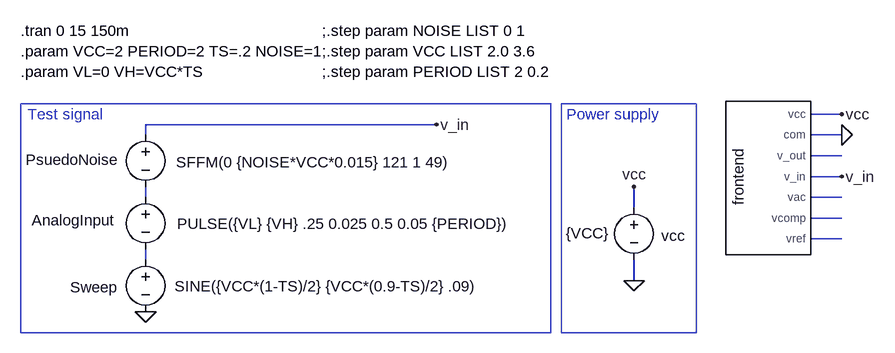
[diagram p0: schematic frontend-test.asc]
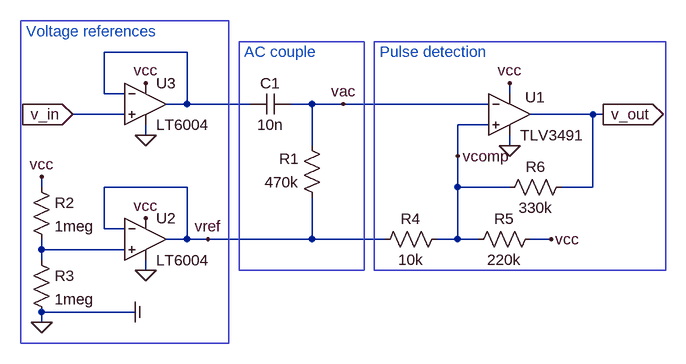
[diagram p1: sub-circuit frontend.asc]
frontend-test.asc, the LTspice schematic file:
Version 4
SHEET 1 2788 5112
WIRE -224 -112 -272 -112
WIRE -848 -96 -1296 -96
WIRE -1296 -80 -1296 -96
WIRE -224 -80 -272 -80
WIRE -224 -48 -272 -48
WIRE -224 -16 -272 -16
WIRE -1296 16 -1296 0
WIRE -224 16 -272 16
WIRE -544 32 -544 0
WIRE -224 48 -272 48
WIRE -224 80 -272 80
WIRE -1296 112 -1296 96
WIRE -544 144 -544 112
FLAG -544 144 0
FLAG -1296 192 0
FLAG -848 -96 v_in
FLAG -544 0 vcc
FLAG -224 -112 vcc
FLAG -224 -16 v_in
FLAG -224 -80 0
SYMBOL voltage -544 16 R0
WINDOW 3 -38 55 Right 2
WINDOW 123 0 0 Left 2
WINDOW 39 0 0 Left 2
WINDOW 0 78 59 Right 2
SYMATTR Value {VCC}
SYMATTR InstName vcc
SYMBOL voltage -1296 -96 R0
WINDOW 0 -113 70 Bottom 2
WINDOW 3 47 58 Left 2
WINDOW 123 0 0 Left 2
WINDOW 39 93 56 VBottom 2
SYMATTR InstName PsuedoNoise
SYMATTR Value SFFM(0 {NOISE*VCC*0.015} 121 1 49)
SYMBOL voltage -1296 0 R0
WINDOW 0 -111 67 Bottom 2
WINDOW 3 49 57 Left 2
WINDOW 123 0 0 Left 2
WINDOW 39 0 0 Left 2
SYMATTR InstName AnalogInput
SYMATTR Value PULSE({VL} {VH} .25 0.025 0.5 0.05 {PERIOD})
SYMBOL voltage -1296 96 R0
WINDOW 0 -116 58 Left 2
WINDOW 3 45 57 Left 2
WINDOW 123 0 0 Left 2
WINDOW 39 0 0 Left 2
SYMATTR InstName Sweep
SYMATTR Value SINE({VCC*(1-TS)/2} {VCC*(0.9-TS)/2} .09)
SYMBOL frontend -304 -16 R0
WINDOW 0 -79 44 VLeft 2
SYMATTR InstName frontend
TEXT -1488 -240 Left 2 !.tran 0 15 150m \n.param VCC=2 PERIOD=2 TS=.2 NOISE=1\n.param VL=0 VH=VCC*TS
TEXT -1360 -112 Right 2 ;Test signal
TEXT -648 -112 Left 2 ;Power supply
TEXT -1024 -240 Left 2 !;.step param NOISE LIST 0 1\n;.step param VCC LIST 2.0 3.6\n;.step param PERIOD LIST 2 0.2
RECTANGLE Normal -1488 -128 -672 224
RECTANGLE Normal -448 224 -656 -128

frontend.asc, the sub-circuit schematic file:
Version 4
SHEET 1 920 680
WIRE -336 -432 -464 -432
WIRE -464 -368 -464 -432
WIRE -432 -368 -464 -368
WIRE 160 -368 160 -384
WIRE -336 -352 -336 -432
WIRE -336 -352 -368 -352
WIRE -240 -352 -336 -352
WIRE -144 -352 -176 -352
WIRE -96 -352 -144 -352
WIRE 128 -352 -96 -352
WIRE -432 -336 -512 -336
WIRE 288 -336 192 -336
WIRE 304 -336 288 -336
WIRE 128 -320 80 -320
WIRE -400 -304 -400 -320
WIRE -144 -288 -144 -352
WIRE 160 -288 160 -304
WIRE 80 -272 80 -320
WIRE -560 -224 -560 -240
WIRE -336 -224 -464 -224
WIRE 80 -224 80 -272
WIRE 160 -224 80 -224
WIRE 288 -224 288 -336
WIRE 288 -224 240 -224
WIRE -464 -160 -464 -224
WIRE -432 -160 -464 -160
WIRE -336 -144 -336 -224
WIRE -336 -144 -368 -144
WIRE -304 -144 -336 -144
WIRE -144 -144 -144 -208
WIRE -144 -144 -304 -144
WIRE -32 -144 -144 -144
WIRE 80 -144 80 -224
WIRE 80 -144 48 -144
WIRE 112 -144 80 -144
WIRE 224 -144 192 -144
WIRE -560 -128 -560 -144
WIRE -432 -128 -560 -128
WIRE -560 -112 -560 -128
WIRE -400 -96 -400 -112
WIRE -416 -32 -560 -32
WIRE -560 -16 -560 -32
FLAG 160 -384 vcc
FLAG 160 -288 0
FLAG 304 -336 v_out
IOPIN 304 -336 Out
FLAG -96 -352 vac
FLAG -560 -240 vcc
FLAG -400 -176 vcc
FLAG -400 -96 0
FLAG -304 -144 vref
FLAG 80 -272 vcomp
FLAG 224 -144 vcc
FLAG -512 -336 v_in
IOPIN -512 -336 In
FLAG -400 -384 vcc
FLAG -400 -304 0
FLAG -560 -16 0
FLAG -416 -32 COM
SYMBOL res -128 -192 R180
WINDOW 0 36 76 Left 2
WINDOW 3 36 40 Left 2
SYMATTR InstName R1
SYMATTR Value 470k
SYMBOL cap -176 -368 R90
WINDOW 0 0 32 VBottom 2
WINDOW 3 32 32 VTop 2
SYMATTR InstName C1
SYMATTR Value 10n
SYMBOL res -576 -240 R0
SYMATTR InstName R2
SYMATTR Value 1meg
SYMATTR SpiceLine tol=2 pwr=0.25
SYMBOL res -576 -128 R0
SYMATTR InstName R3
SYMATTR Value 1meg
SYMATTR SpiceLine tol=2 pwr=0.25
SYMBOL SBORKA\\COMPARATOR\\TLV3491 160 -336 R0
WINDOW 38 12 37 Left 2
WINDOW 0 24 -26 Left 2
SYMATTR InstName U1
SYMBOL Opamps\\LT6004 -400 -144 R0
SYMATTR InstName U2
SYMBOL res 64 -160 R90
WINDOW 0 0 56 VBottom 2
WINDOW 3 32 56 VTop 2
SYMATTR InstName R4
SYMATTR Value 10k
SYMBOL res 208 -160 R90
WINDOW 0 0 56 VBottom 2
WINDOW 3 32 56 VTop 2
SYMATTR InstName R5
SYMATTR Value 220k
SYMBOL res 256 -240 R90
WINDOW 0 0 56 VBottom 2
WINDOW 3 32 56 VTop 2
SYMATTR InstName R6
SYMATTR Value 330k
SYMBOL Opamps\\LT6004 -400 -352 R0
SYMATTR InstName U3
TEXT -584 -464 Left 2 ;Voltage references
TEXT -40 -432 Left 2 ;Pulse detection
TEXT -248 -432 Left 2 ;AC couple
RECTANGLE Normal -272 16 -592 -480
RECTANGLE Normal 400 -448 -48 -96
RECTANGLE Normal -64 -448 -256 -96

The netlist it stands for:
* frontend-test.asc
vcc vcc 0 {VCC}
V§PsuedoNoise v_in N002 SFFM(0 {NOISE*VCC*0.015} 121 1 49)
V§AnalogInput N002 N006 PULSE({VL} {VH} .25 0.025 0.5 0.05 {PERIOD})
V§Sweep N006 0 SINE({VCC*(1-TS)/2} {VCC*(0.9-TS)/2} .09)
Xfrontend 0 vcc v_in N001 N003 N004 N005 frontend

* block symbol definitions
.subckt frontend com vcc v_in v_out vac vcomp vref
R1 vref vac 470k
C1 vac N001 10n
R2 vcc N002 1meg tol=2 pwr=0.25
R3 N002 0 1meg tol=2 pwr=0.25
* U1: TLV3491 (symbol SBORKA\COMPARATOR\TLV3491 not available, pins judged from their places): In+=vcomp In-=vac V+=vcc V-=0 OUT=v_out
* U2: LT6004 (symbol Opamps\LT6004 not available, pins judged from their places): In+=N002 In-=vref V+=vcc V-=0 OUT=vref
R4 vcomp vref 10k
R5 vcc vcomp 220k
R6 v_out vcomp 330k
* U3: LT6004 (symbol Opamps\LT6004 not available, pins judged from their places): In+=v_in In-=N001 V+=vcc V-=0 OUT=N001
* Voltage references
* Pulse detection
* AC couple
.ends frontend

.tran 0 15 150m
.param VCC=2 PERIOD=2 TS=.2 NOISE=1
.param VL=0 VH=VCC*TS
* Test signal
* Power supply
;.step param NOISE LIST 0 1
;.step param VCC LIST 2.0 3.6
;.step param PERIOD LIST 2 0.2
.backanno
.end